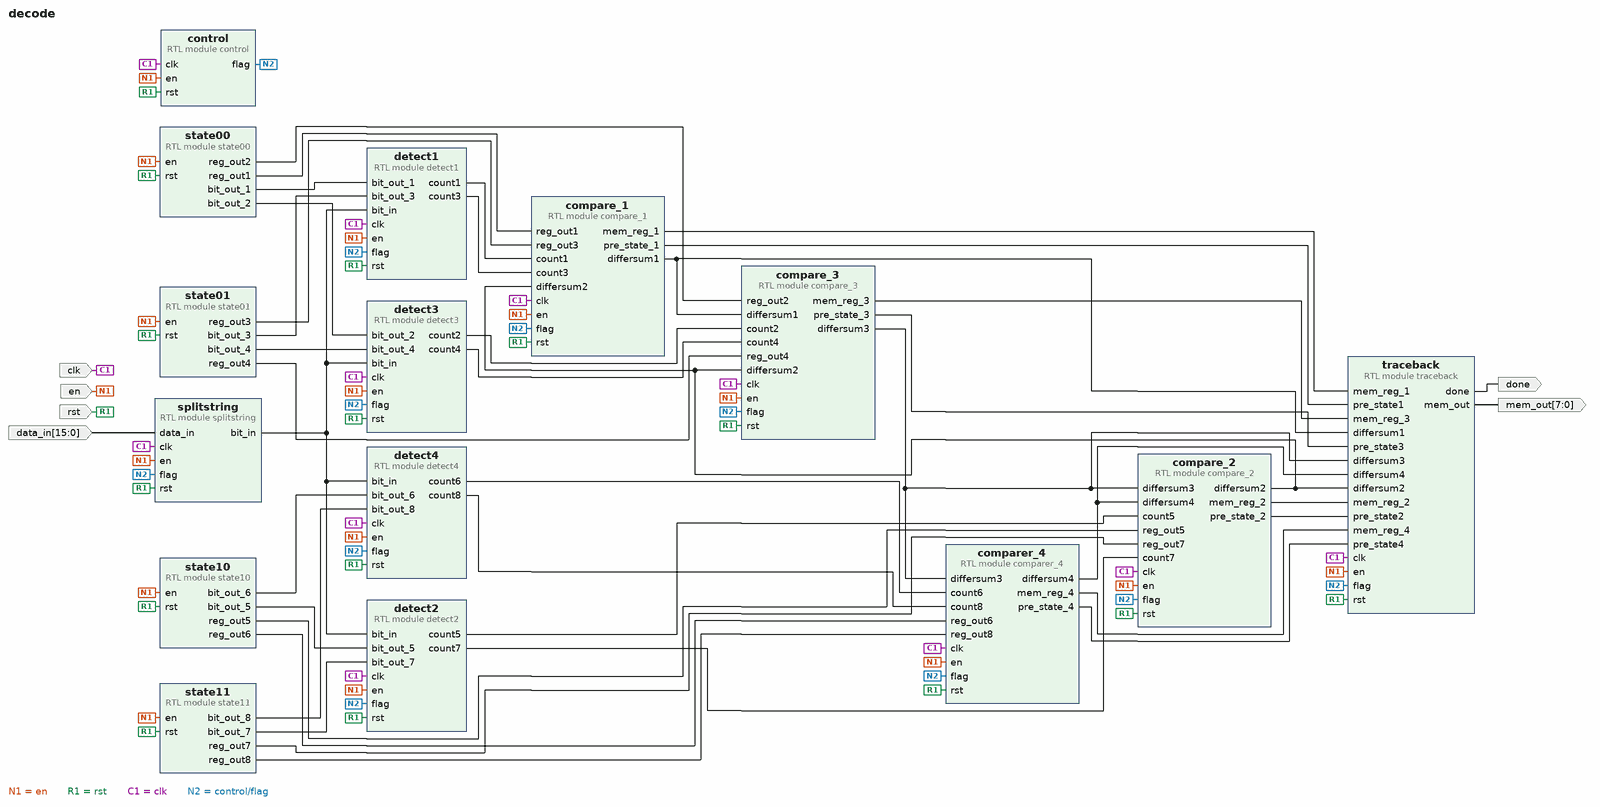
[diagram p0: block diagram of the top level]
# Vivado block design decode, xc7vx485tffg1157-1, Vivado 2018.3
create_bd_design decode

create_bd_port -dir I en
create_bd_port -dir I -type rst rst
create_bd_port -dir I -type clk clk
set_property -dict {CONFIG.ASSOCIATED_RESET rst} [get_bd_ports clk]
create_bd_port -dir I -from 15 -to 0 data_in
create_bd_port -dir O -from 7 -to 0 mem_out
create_bd_port -dir O done

create_bd_cell -type module -reference state00 state00
create_bd_cell -type module -reference state01 state01
create_bd_cell -type module -reference state10 state10
create_bd_cell -type module -reference state11 state11
create_bd_cell -type module -reference splitstring splitstring
create_bd_cell -type module -reference control control
create_bd_cell -type module -reference compare_1 compare_1
create_bd_cell -type module -reference compare_2 compare_2
create_bd_cell -type module -reference compare_3 compare_3
create_bd_cell -type module -reference comparer_4 comparer_4
create_bd_cell -type module -reference traceback traceback
create_bd_cell -type module -reference detect1 detect1
create_bd_cell -type module -reference detect2 detect2
create_bd_cell -type module -reference detect3 detect3
create_bd_cell -type module -reference detect4 detect4

# ---- connections ----

connect_bd_net -net en_0_1 [get_bd_ports en] \
  [get_bd_pins state00/en] [get_bd_pins state01/en] [get_bd_pins state10/en] [get_bd_pins state11/en] \
  [get_bd_pins splitstring/en] [get_bd_pins control/en] [get_bd_pins compare_1/en] [get_bd_pins compare_2/en] \
  [get_bd_pins compare_3/en] [get_bd_pins comparer_4/en] [get_bd_pins detect1/en] [get_bd_pins detect3/en] \
  [get_bd_pins detect4/en] [get_bd_pins detect2/en] [get_bd_pins traceback/en]
connect_bd_net -net rst_0_1 [get_bd_ports rst] \
  [get_bd_pins state00/rst] [get_bd_pins state01/rst] [get_bd_pins state10/rst] [get_bd_pins state11/rst] \
  [get_bd_pins splitstring/rst] [get_bd_pins control/rst] [get_bd_pins detect1/rst] [get_bd_pins detect3/rst] \
  [get_bd_pins detect4/rst] [get_bd_pins detect2/rst] [get_bd_pins compare_1/rst] [get_bd_pins compare_3/rst] \
  [get_bd_pins traceback/rst] [get_bd_pins comparer_4/rst] [get_bd_pins compare_2/rst]
connect_bd_net -net clk_0_1 [get_bd_ports clk] \
  [get_bd_pins splitstring/clk] [get_bd_pins control/clk] [get_bd_pins compare_1/clk] [get_bd_pins compare_2/clk] \
  [get_bd_pins compare_3/clk] [get_bd_pins comparer_4/clk] [get_bd_pins detect1/clk] [get_bd_pins detect3/clk] \
  [get_bd_pins detect4/clk] [get_bd_pins detect2/clk] [get_bd_pins traceback/clk]
connect_bd_net -net data_in_0_1 [get_bd_ports data_in] [get_bd_pins splitstring/data_in]
connect_bd_net -net control_0_flag [get_bd_pins control/flag] \
  [get_bd_pins splitstring/flag] [get_bd_pins compare_1/flag] [get_bd_pins compare_2/flag] [get_bd_pins compare_3/flag] \
  [get_bd_pins comparer_4/flag] [get_bd_pins traceback/flag] [get_bd_pins detect4/flag] [get_bd_pins detect2/flag] \
  [get_bd_pins detect3/flag] [get_bd_pins detect1/flag]
connect_bd_net -net splitstring_0_bit_in [get_bd_pins splitstring/bit_in] \
  [get_bd_pins detect1/bit_in] [get_bd_pins detect3/bit_in] [get_bd_pins detect4/bit_in] [get_bd_pins detect2/bit_in]
connect_bd_net -net traceback_0_mem_out [get_bd_pins traceback/mem_out] [get_bd_ports mem_out]
connect_bd_net -net traceback_0_done [get_bd_pins traceback/done] [get_bd_ports done]
connect_bd_net -net state00_0_bit_out_1 [get_bd_pins state00/bit_out_1] [get_bd_pins detect1/bit_out_1]
connect_bd_net -net state00_0_reg_out1 [get_bd_pins state00/reg_out1] [get_bd_pins compare_1/reg_out1]
connect_bd_net -net state01_0_bit_out_3 [get_bd_pins state01/bit_out_3] [get_bd_pins detect1/bit_out_3]
connect_bd_net -net state01_0_reg_out3 [get_bd_pins state01/reg_out3] [get_bd_pins compare_1/reg_out3]
connect_bd_net -net compare_2_0_differsum2 [get_bd_pins compare_2/differsum2] \
  [get_bd_pins compare_1/differsum2] [get_bd_pins compare_3/differsum2] [get_bd_pins traceback/differsum2]
connect_bd_net -net state10_0_bit_out_5 [get_bd_pins state10/bit_out_5] [get_bd_pins detect2/bit_out_5]
connect_bd_net -net state10_0_reg_out5 [get_bd_pins state10/reg_out5] [get_bd_pins compare_2/reg_out5]
connect_bd_net -net state11_0_bit_out_7 [get_bd_pins state11/bit_out_7] [get_bd_pins detect2/bit_out_7]
connect_bd_net -net state11_0_reg_out7 [get_bd_pins state11/reg_out7] [get_bd_pins compare_2/reg_out7]
connect_bd_net -net compare_3_0_differsum3 [get_bd_pins compare_3/differsum3] \
  [get_bd_pins compare_2/differsum3] [get_bd_pins comparer_4/differsum3] [get_bd_pins traceback/differsum3]
connect_bd_net -net comparer_4_0_differsum4 [get_bd_pins comparer_4/differsum4] [get_bd_pins compare_2/differsum4] [get_bd_pins traceback/differsum4]
connect_bd_net -net state00_0_bit_out_2 [get_bd_pins state00/bit_out_2] [get_bd_pins detect3/bit_out_2]
connect_bd_net -net state00_0_reg_out2 [get_bd_pins state00/reg_out2] [get_bd_pins compare_3/reg_out2]
connect_bd_net -net state01_0_bit_out_4 [get_bd_pins state01/bit_out_4] [get_bd_pins detect3/bit_out_4]
connect_bd_net -net state01_0_reg_out4 [get_bd_pins state01/reg_out4] [get_bd_pins compare_3/reg_out4]
connect_bd_net -net compare_1_0_differsum1 [get_bd_pins compare_1/differsum1] [get_bd_pins compare_3/differsum1] [get_bd_pins traceback/differsum1]
connect_bd_net -net state10_0_bit_out_6 [get_bd_pins state10/bit_out_6] [get_bd_pins detect4/bit_out_6]
connect_bd_net -net state10_0_reg_out6 [get_bd_pins state10/reg_out6] [get_bd_pins comparer_4/reg_out6]
connect_bd_net -net state11_0_bit_out_8 [get_bd_pins state11/bit_out_8] [get_bd_pins detect4/bit_out_8]
connect_bd_net -net state11_0_reg_out8 [get_bd_pins state11/reg_out8] [get_bd_pins comparer_4/reg_out8]
connect_bd_net -net compare_1_0_mem_reg_1 [get_bd_pins compare_1/mem_reg_1] [get_bd_pins traceback/mem_reg_1]
connect_bd_net -net compare_1_0_pre_state_1 [get_bd_pins compare_1/pre_state_1] [get_bd_pins traceback/pre_state1]
connect_bd_net -net compare_2_0_mem_reg_2 [get_bd_pins compare_2/mem_reg_2] [get_bd_pins traceback/mem_reg_2]
connect_bd_net -net compare_2_0_pre_state_2 [get_bd_pins compare_2/pre_state_2] [get_bd_pins traceback/pre_state2]
connect_bd_net -net compare_3_0_mem_reg_3 [get_bd_pins compare_3/mem_reg_3] [get_bd_pins traceback/mem_reg_3]
connect_bd_net -net compare_3_0_pre_state_3 [get_bd_pins compare_3/pre_state_3] [get_bd_pins traceback/pre_state3]
connect_bd_net -net comparer_4_0_mem_reg_4 [get_bd_pins comparer_4/mem_reg_4] [get_bd_pins traceback/mem_reg_4]
connect_bd_net -net comparer_4_0_pre_state_4 [get_bd_pins comparer_4/pre_state_4] [get_bd_pins traceback/pre_state4]
connect_bd_net -net detect1_0_count1 [get_bd_pins detect1/count1] [get_bd_pins compare_1/count1]
connect_bd_net -net detect4_0_count6 [get_bd_pins detect4/count6] [get_bd_pins comparer_4/count6]
connect_bd_net -net detect4_0_count8 [get_bd_pins detect4/count8] [get_bd_pins comparer_4/count8]
connect_bd_net -net detect2_0_count5 [get_bd_pins detect2/count5] [get_bd_pins compare_2/count5]
connect_bd_net -net detect2_0_count7 [get_bd_pins detect2/count7] [get_bd_pins compare_2/count7]
connect_bd_net -net detect3_0_count2 [get_bd_pins detect3/count2] [get_bd_pins compare_3/count2]
connect_bd_net -net detect3_0_count4 [get_bd_pins detect3/count4] [get_bd_pins compare_3/count4]
connect_bd_net -net detect1_0_count3 [get_bd_pins detect1/count3] [get_bd_pins compare_1/count3]

validate_bd_design
save_bd_design
